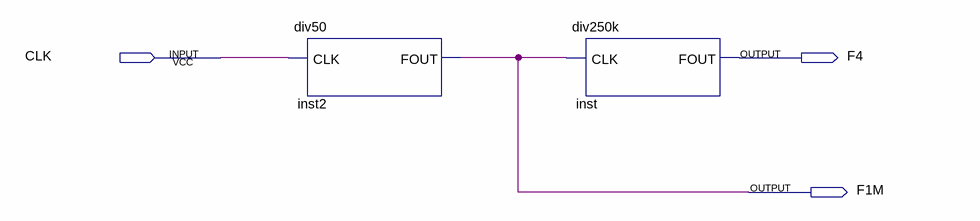
[diagram p0: schematic sheet]
// Quartus schematic divf.bdf as structural Verilog: 2 symbols, 3 pins
module divf (
  input  CLK,
  output F4,
  output F1M
);

  div50 inst2 (.CLK(CLK), .FOUT(F1M));
  div250k inst (.CLK(F1M), .FOUT(F4));
endmodule
